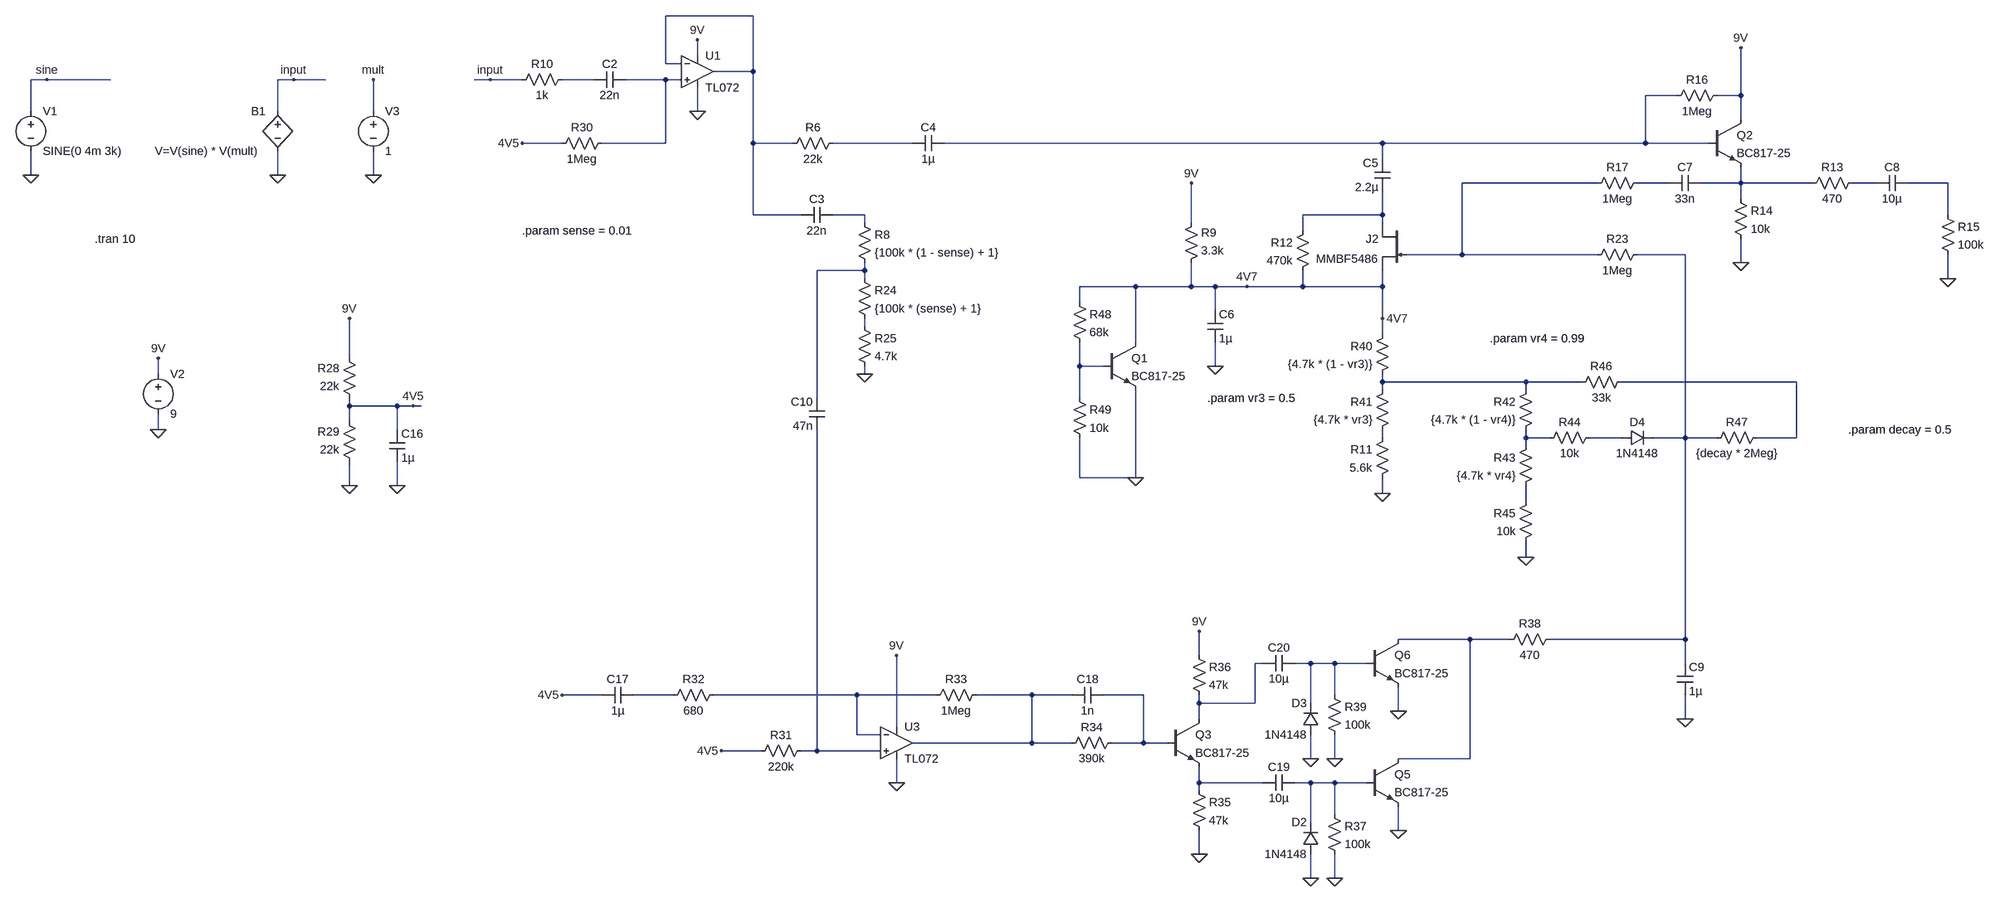
[diagram p0: schematic boss_NF1_modern_components.asc]
boss_NF1_modern_components.asc, the LTspice schematic file:
Version 4
SHEET 1 4932 4532
WIRE -48 2336 -224 2336
WIRE -160 2416 -160 2384
WIRE -224 2432 -224 2336
WIRE -192 2432 -224 2432
WIRE -48 2448 -48 2336
WIRE -48 2448 -128 2448
WIRE -1472 2464 -1504 2464
WIRE -1344 2464 -1472 2464
WIRE -976 2464 -1008 2464
WIRE -912 2464 -976 2464
WIRE -576 2464 -608 2464
WIRE -512 2464 -576 2464
WIRE -368 2464 -432 2464
WIRE -224 2464 -304 2464
WIRE -192 2464 -224 2464
WIRE 1808 2496 1744 2496
WIRE 1936 2496 1936 2400
WIRE 1936 2496 1888 2496
WIRE -1504 2528 -1504 2464
WIRE -1008 2528 -1008 2464
WIRE -816 2528 -816 2464
WIRE -160 2528 -160 2480
WIRE 1936 2544 1936 2496
WIRE -432 2592 -512 2592
WIRE -224 2592 -224 2464
WIRE -224 2592 -352 2592
WIRE -48 2592 -48 2448
WIRE 32 2592 -48 2592
WIRE 272 2592 112 2592
WIRE 1216 2592 336 2592
WIRE 1744 2592 1744 2496
WIRE 1744 2592 1216 2592
WIRE 1872 2592 1744 2592
WIRE 1216 2624 1216 2592
WIRE -1504 2656 -1504 2608
WIRE -1008 2656 -1008 2608
WIRE -816 2656 -816 2608
WIRE 1648 2672 1376 2672
WIRE 1792 2672 1728 2672
WIRE 1936 2672 1936 2640
WIRE 1936 2672 1856 2672
WIRE 2080 2672 1936 2672
WIRE 2208 2672 2160 2672
WIRE 2352 2672 2272 2672
WIRE 1936 2704 1936 2672
WIRE -48 2736 -48 2592
WIRE 48 2736 -48 2736
WIRE 176 2736 112 2736
WIRE 1216 2736 1216 2688
WIRE 1216 2736 1056 2736
WIRE 2352 2736 2352 2672
WIRE 176 2752 176 2736
WIRE 832 2752 832 2672
WIRE 1216 2752 1216 2736
WIRE 1056 2768 1056 2736
WIRE 1376 2816 1376 2672
WIRE 1376 2816 1264 2816
WIRE 1648 2816 1376 2816
WIRE 1824 2816 1728 2816
WIRE 1936 2832 1936 2784
WIRE 176 2848 176 2832
WIRE 176 2848 80 2848
WIRE 176 2864 176 2848
WIRE 2352 2864 2352 2816
WIRE 720 2880 608 2880
WIRE 832 2880 832 2832
WIRE 832 2880 720 2880
WIRE 880 2880 832 2880
WIRE 944 2880 880 2880
WIRE 1056 2880 1056 2848
WIRE 1056 2880 944 2880
WIRE 1216 2880 1216 2848
WIRE 1216 2880 1056 2880
WIRE 608 2912 608 2880
WIRE 880 2928 880 2880
WIRE 1216 2944 1216 2880
WIRE 176 2960 176 2944
WIRE 1216 2976 1216 2944
WIRE 720 2992 720 2880
WIRE -864 3024 -864 2944
WIRE 608 3040 608 2992
WIRE 656 3040 608 3040
WIRE 880 3040 880 2992
WIRE -1248 3056 -1248 3024
WIRE 176 3056 176 3040
WIRE 1216 3072 1216 3056
WIRE 1504 3072 1216 3072
WIRE 1616 3072 1504 3072
WIRE 2048 3072 1696 3072
WIRE 1216 3088 1216 3072
WIRE 1504 3088 1504 3072
WIRE 80 3104 80 2848
WIRE 608 3104 608 3040
WIRE -864 3120 -864 3104
WIRE -768 3120 -864 3120
WIRE -736 3120 -768 3120
WIRE -720 3120 -736 3120
WIRE -864 3152 -864 3120
WIRE -1248 3168 -1248 3136
WIRE -768 3168 -768 3120
WIRE 1216 3184 1216 3168
WIRE 1504 3184 1504 3168
WIRE 1552 3184 1504 3184
WIRE 1696 3184 1632 3184
WIRE 1824 3184 1824 2816
WIRE 1824 3184 1760 3184
WIRE 1888 3184 1824 3184
WIRE 2048 3184 2048 3072
WIRE 2048 3184 1968 3184
WIRE 1504 3200 1504 3184
WIRE 608 3264 608 3184
WIRE 720 3264 720 3088
WIRE 720 3264 608 3264
WIRE -864 3280 -864 3232
WIRE -768 3280 -768 3232
WIRE 1216 3296 1216 3264
WIRE 1504 3312 1504 3280
WIRE 1504 3424 1504 3392
WIRE 1392 3856 1248 3856
WIRE 1472 3856 1392 3856
WIRE 1824 3856 1824 3184
WIRE 1824 3856 1552 3856
WIRE 848 3888 848 3840
WIRE 976 3904 960 3904
WIRE 1072 3904 1040 3904
WIRE 1120 3904 1072 3904
WIRE 1184 3904 1120 3904
WIRE 1824 3904 1824 3856
WIRE -352 3968 -432 3968
WIRE -208 3968 -288 3968
WIRE 160 3968 -128 3968
WIRE 320 3968 160 3968
WIRE 512 3968 400 3968
WIRE 592 3968 512 3968
WIRE 736 3968 656 3968
WIRE 1120 3968 1120 3904
WIRE 848 3984 848 3968
WIRE 960 3984 960 3904
WIRE 960 3984 848 3984
WIRE 1072 3984 1072 3904
WIRE 1248 4000 1248 3952
WIRE 848 4016 848 3984
WIRE 1824 4016 1824 3968
WIRE 240 4032 240 3888
WIRE 160 4048 160 3968
WIRE 208 4048 160 4048
WIRE 512 4064 512 3968
WIRE 512 4064 272 4064
WIRE 592 4064 512 4064
WIRE 736 4064 736 3968
WIRE 736 4064 672 4064
WIRE 784 4064 736 4064
WIRE -32 4080 -112 4080
WIRE 80 4080 80 3168
WIRE 80 4080 48 4080
WIRE 208 4080 80 4080
WIRE 1072 4096 1072 4048
WIRE 1120 4096 1120 4048
WIRE 1392 4096 1392 3856
WIRE 1392 4096 1248 4096
WIRE 240 4144 240 4096
WIRE 848 4144 848 4112
WIRE 976 4144 848 4144
WIRE 1072 4144 1040 4144
WIRE 1120 4144 1072 4144
WIRE 1184 4144 1120 4144
WIRE 848 4160 848 4144
WIRE 1120 4208 1120 4144
WIRE 1072 4224 1072 4144
WIRE 1248 4240 1248 4192
WIRE 848 4288 848 4240
WIRE 1072 4336 1072 4288
WIRE 1120 4336 1120 4288
FLAG -1248 3024 9V
FLAG -1248 3168 0
FLAG -1504 2656 0
FLAG -816 2656 0
FLAG -816 2464 mult
FLAG -1008 2656 0
FLAG -1472 2464 sine
FLAG -976 2464 input
FLAG 176 3056 0
FLAG 880 3040 0
FLAG 1216 3296 0
FLAG 832 2672 9V
FLAG 1936 2832 0
FLAG 1936 2400 9V
FLAG 2352 2864 0
FLAG 1824 4016 0
FLAG 240 3888 9V
FLAG -768 3280 0
FLAG -864 3280 0
FLAG -864 2944 9V
FLAG -736 3120 4V5
FLAG -512 2592 4V5
FLAG -576 2464 input
FLAG -112 4080 4V5
FLAG -432 3968 4V5
FLAG 848 4288 0
FLAG 848 3840 9V
FLAG 1120 4336 0
FLAG 1072 4336 0
FLAG 1248 4240 0
FLAG 1120 4096 0
FLAG 1072 4096 0
FLAG 1248 4000 0
FLAG 944 2880 4V7
FLAG 1216 2944 4V7
FLAG 1504 3424 0
FLAG -160 2384 9V
FLAG -160 2528 0
FLAG 240 4144 0
FLAG 720 3264 0
SYMBOL voltage -1504 2512 R0
WINDOW 123 0 0 Left 0
WINDOW 39 0 0 Left 0
SYMATTR InstName V1
SYMATTR Value SINE(0 4m 3k)
SYMBOL voltage -1248 3040 R0
WINDOW 123 0 0 Left 0
WINDOW 39 0 0 Left 0
SYMATTR InstName V2
SYMATTR Value 9
SYMBOL voltage -816 2512 R0
WINDOW 123 0 0 Left 0
WINDOW 39 0 0 Left 0
SYMATTR InstName V3
SYMATTR Value 1
SYMBOL bv -1008 2512 M0
WINDOW 3 40 96 Left 2
SYMATTR Value V=V(sine) * V(mult)
SYMATTR InstName B1
SYMBOL cap -304 2448 R90
WINDOW 0 0 32 VBottom 2
WINDOW 3 32 32 VTop 2
SYMATTR InstName C2
SYMATTR Value 22n
SYMBOL cap 112 2720 R90
WINDOW 0 0 32 VBottom 2
WINDOW 3 32 32 VTop 2
SYMATTR InstName C3
SYMATTR Value 22n
SYMBOL res 160 2736 R0
SYMATTR InstName R8
SYMATTR Value {100k * (1 - sense) + 1}
SYMBOL res -416 2448 R90
WINDOW 0 0 56 VBottom 2
WINDOW 3 32 56 VTop 2
SYMATTR InstName R10
SYMATTR Value 1k
SYMBOL res 128 2576 R90
WINDOW 0 0 56 VBottom 2
WINDOW 3 32 56 VTop 2
SYMATTR InstName R6
SYMATTR Value 22k
SYMBOL cap 336 2576 R90
WINDOW 0 0 32 VBottom 2
WINDOW 3 32 32 VTop 2
SYMATTR InstName C4
SYMATTR Value 1µ
SYMBOL njf 1264 2752 M0
SYMATTR InstName J2
SYMATTR Value MMBF5486
SYMBOL cap 1232 2624 M0
SYMATTR InstName C5
SYMATTR Value 2.2µ
SYMBOL cap 864 2928 R0
SYMATTR InstName C6
SYMATTR Value 1µ
SYMBOL res 816 2848 M180
WINDOW 0 36 76 Left 2
WINDOW 3 36 40 Left 2
SYMATTR InstName R9
SYMATTR Value 3.3k
SYMBOL res 1232 3168 M0
SYMATTR InstName R11
SYMATTR Value 5.6k
SYMBOL res 1072 2752 M0
SYMATTR InstName R12
SYMATTR Value 470k
SYMBOL npn 1872 2544 R0
SYMATTR InstName Q2
SYMATTR Value BC817-25
SYMBOL res 1920 2688 R0
SYMATTR InstName R14
SYMATTR Value 10k
SYMBOL cap 2272 2656 R90
WINDOW 0 0 32 VBottom 2
WINDOW 3 32 32 VTop 2
SYMATTR InstName C8
SYMATTR Value 10µ
SYMBOL res 2336 2720 R0
SYMATTR InstName R15
SYMATTR Value 100k
SYMBOL res 1904 2480 R90
WINDOW 0 0 56 VBottom 2
WINDOW 3 32 56 VTop 2
SYMATTR InstName R16
SYMATTR Value 1Meg
SYMBOL res 2176 2656 R90
WINDOW 0 0 56 VBottom 2
WINDOW 3 32 56 VTop 2
SYMATTR InstName R13
SYMATTR Value 470
SYMBOL res 1744 2656 R90
WINDOW 0 0 56 VBottom 2
WINDOW 3 32 56 VTop 2
SYMATTR InstName R17
SYMATTR Value 1Meg
SYMBOL cap 1856 2656 R90
WINDOW 0 0 32 VBottom 2
WINDOW 3 32 32 VTop 2
SYMATTR InstName C7
SYMATTR Value 33n
SYMBOL res 1744 2800 R90
WINDOW 0 0 56 VBottom 2
WINDOW 3 32 56 VTop 2
SYMATTR InstName R23
SYMATTR Value 1Meg
SYMBOL cap 1808 3904 R0
SYMATTR InstName C9
SYMATTR Value 1µ
SYMBOL res 160 2848 R0
SYMATTR InstName R24
SYMATTR Value {100k * (sense) + 1}
SYMBOL res 160 2944 R0
SYMATTR InstName R25
SYMATTR Value 4.7k
SYMBOL cap 96 3168 R180
WINDOW 0 24 56 Left 2
WINDOW 3 24 8 Left 2
SYMATTR InstName C10
SYMATTR Value 47n
SYMBOL res -848 3120 R180
WINDOW 0 36 76 Left 2
WINDOW 3 36 40 Left 2
SYMATTR InstName R28
SYMATTR Value 22k
SYMBOL cap -784 3168 R0
SYMATTR InstName C16
SYMATTR Value 1µ
SYMBOL res -848 3248 R180
WINDOW 0 36 76 Left 2
WINDOW 3 36 40 Left 2
SYMATTR InstName R29
SYMATTR Value 22k
SYMBOL res -336 2576 R90
WINDOW 0 0 56 VBottom 2
WINDOW 3 32 56 VTop 2
SYMATTR InstName R30
SYMATTR Value 1Meg
SYMBOL res 64 4064 R90
WINDOW 0 0 56 VBottom 2
WINDOW 3 32 56 VTop 2
SYMATTR InstName R31
SYMATTR Value 220k
SYMBOL cap -288 3952 R90
WINDOW 0 0 32 VBottom 2
WINDOW 3 32 32 VTop 2
SYMATTR InstName C17
SYMATTR Value 1µ
SYMBOL res -112 3952 R90
WINDOW 0 0 56 VBottom 2
WINDOW 3 32 56 VTop 2
SYMATTR InstName R32
SYMATTR Value 680
SYMBOL res 416 3952 R90
WINDOW 0 0 56 VBottom 2
WINDOW 3 32 56 VTop 2
SYMATTR InstName R33
SYMATTR Value 1Meg
SYMBOL res 688 4048 R90
WINDOW 0 0 56 VBottom 2
WINDOW 3 32 56 VTop 2
SYMATTR InstName R34
SYMATTR Value 390k
SYMBOL cap 656 3952 R90
WINDOW 0 0 32 VBottom 2
WINDOW 3 32 32 VTop 2
SYMATTR InstName C18
SYMATTR Value 1n
SYMBOL npn 784 4016 R0
SYMATTR InstName Q3
SYMATTR Value BC817-25
SYMBOL res 832 4144 R0
SYMATTR InstName R35
SYMATTR Value 47k
SYMBOL res 832 3872 R0
SYMATTR InstName R36
SYMATTR Value 47k
SYMBOL npn 1184 4096 R0
SYMATTR InstName Q5
SYMATTR Value BC817-25
SYMBOL res 1104 4192 R0
SYMATTR InstName R37
SYMATTR Value 100k
SYMBOL diode 1088 4288 R180
WINDOW 0 24 64 Left 2
WINDOW 3 24 0 Left 2
SYMATTR InstName D2
SYMATTR Value 1N4148
SYMBOL res 1456 3872 R270
WINDOW 0 32 56 VTop 2
WINDOW 3 0 56 VBottom 2
SYMATTR InstName R38
SYMATTR Value 470
SYMBOL npn 1184 3856 R0
SYMATTR InstName Q6
SYMATTR Value BC817-25
SYMBOL res 1104 3952 R0
SYMATTR InstName R39
SYMATTR Value 100k
SYMBOL diode 1088 4048 R180
WINDOW 0 24 64 Left 2
WINDOW 3 24 0 Left 2
SYMATTR InstName D3
SYMATTR Value 1N4148
SYMBOL cap 1040 4128 R90
WINDOW 0 0 32 VBottom 2
WINDOW 3 32 32 VTop 2
SYMATTR InstName C19
SYMATTR Value 10µ
SYMBOL cap 1040 3888 R90
WINDOW 0 0 32 VBottom 2
WINDOW 3 32 32 VTop 2
SYMATTR InstName C20
SYMATTR Value 10µ
SYMBOL res 1232 2960 M0
SYMATTR InstName R40
SYMATTR Value {4.7k * (1 - vr3)}
SYMBOL res 1232 3072 M0
SYMATTR InstName R41
SYMATTR Value {4.7k * vr3}
SYMBOL res 1520 3072 M0
SYMATTR InstName R42
SYMATTR Value {4.7k * (1 - vr4)}
SYMBOL res 1520 3184 M0
SYMATTR InstName R43
SYMATTR Value {4.7k * vr4}
SYMBOL diode 1696 3200 R270
WINDOW 0 32 32 VTop 2
WINDOW 3 0 32 VBottom 2
SYMATTR InstName D4
SYMATTR Value 1N4148
SYMBOL res 1648 3168 R90
WINDOW 0 0 56 VBottom 2
WINDOW 3 32 56 VTop 2
SYMATTR InstName R44
SYMATTR Value 10k
SYMBOL res 1520 3296 M0
SYMATTR InstName R45
SYMATTR Value 10k
SYMBOL res 1712 3056 R90
WINDOW 0 0 56 VBottom 2
WINDOW 3 32 56 VTop 2
SYMATTR InstName R46
SYMATTR Value 33k
SYMBOL res 1984 3168 R90
WINDOW 0 0 56 VBottom 2
WINDOW 3 32 56 VTop 2
SYMATTR InstName R47
SYMATTR Value {decay * 2Meg}
SYMBOL ZZZ\\OpAmp\\TL072 -160 2448 R0
SYMATTR InstName U1
SYMBOL ZZZ\\OpAmp\\TL072 240 4064 R0
SYMATTR InstName U3
SYMBOL npn 656 2992 R0
SYMATTR InstName Q1
SYMATTR Value BC817-25
SYMBOL res 592 2896 R0
SYMATTR InstName R48
SYMATTR Value 68k
SYMBOL res 592 3088 R0
SYMATTR InstName R49
SYMATTR Value 10k
TEXT -1376 2784 Left 2 !.tran 10
TEXT -512 2768 Left 2 !.param sense = 0.01
TEXT 864 3104 Left 2 !.param vr3 = 0.5
TEXT 1432 2984 Left 2 !.param vr4 = 0.99
TEXT 2152 3168 Left 2 !.param decay = 0.5

The netlist it stands for:
* boss_NF1_modern_components.asc
V1 sine 0 SINE(0 4m 3k)
V2 9V 0 9
V3 mult 0 1
B1 input 0 V=V(sine) * V(mult)
C2 N003 N002 22n
C3 N011 N001 22n
R8 N011 N014 {100k * (1 - sense) + 1}
R10 N002 input 1k
R6 N005 N001 22k
C4 N004 N005 1µ
J2 N012 N006 4V7 MMBF5486
C5 N004 N012 2.2µ
C6 4V7 0 1µ
R9 4V7 9V 3.3k
R11 N019 0 5.6k
R12 N012 4V7 470k
Q2 9V N004 N008 0 BC817-25
R14 N008 0 10k
C8 N010 N009 10µ
R15 N010 0 100k
R16 9V N004 1Meg
R13 N009 N008 470
R17 N007 N006 1Meg
C7 N008 N007 33n
R23 N013 N006 1Meg
C9 N013 0 1µ
R24 N014 N015 {100k * (sense) + 1}
R25 N015 0 4.7k
C10 N030 N014 47n
R28 4V5 9V 22k
C16 4V5 0 1µ
R29 0 4V5 22k
R30 N003 4V5 1Meg
R31 N030 4V5 220k
C17 N026 4V5 1µ
R32 N027 N026 680
R33 N028 N027 1Meg
R34 N029 N028 390k
C18 N029 N028 1n
Q3 N024 N029 N031 0 BC817-25
R35 N031 0 47k
R36 9V N024 47k
Q5 N023 N032 0 0 BC817-25
R37 N032 0 100k
D2 0 N032 1N4148
R38 N023 N013 470
Q6 N023 N025 0 0 BC817-25
R39 N025 0 100k
D3 0 N025 1N4148
C19 N032 N031 10µ
C20 N025 N024 10µ
R40 4V7 N017 {4.7k * (1 - vr3)}
R41 N017 N019 {4.7k * vr3}
R42 N017 N020 {4.7k * (1 - vr4)}
R43 N020 N022 {4.7k * vr4}
D4 N021 N013 1N4148
R44 N021 N020 10k
R45 N022 0 10k
R46 N018 N017 33k
R47 N018 N013 {decay * 2Meg}
* U1: TL072 (symbol ZZZ\OpAmp\TL072 not available, pins judged from their places): In+=N003 In-=N001 V+=9V V-=0 OUT=N001
* U3: TL072 (symbol ZZZ\OpAmp\TL072 not available, pins judged from their places): In+=N030 In-=N027 V+=9V V-=0 OUT=N028
Q1 4V7 N016 0 0 BC817-25
R48 4V7 N016 68k
R49 N016 0 10k
.model D D
.lib standard.dio
.model NPN NPN
.model PNP PNP
.lib standard.bjt
.model NJF NJF
.model PJF PJF
.lib standard.jft
.tran 10
.param sense = 0.01
.param vr3 = 0.5
.param vr4 = 0.99
.param decay = 0.5
.backanno
.end